# Altium schematic sheet USB3toSerial.SchDoc
size A4; SheetNumber: 4; SheetTotal: 5
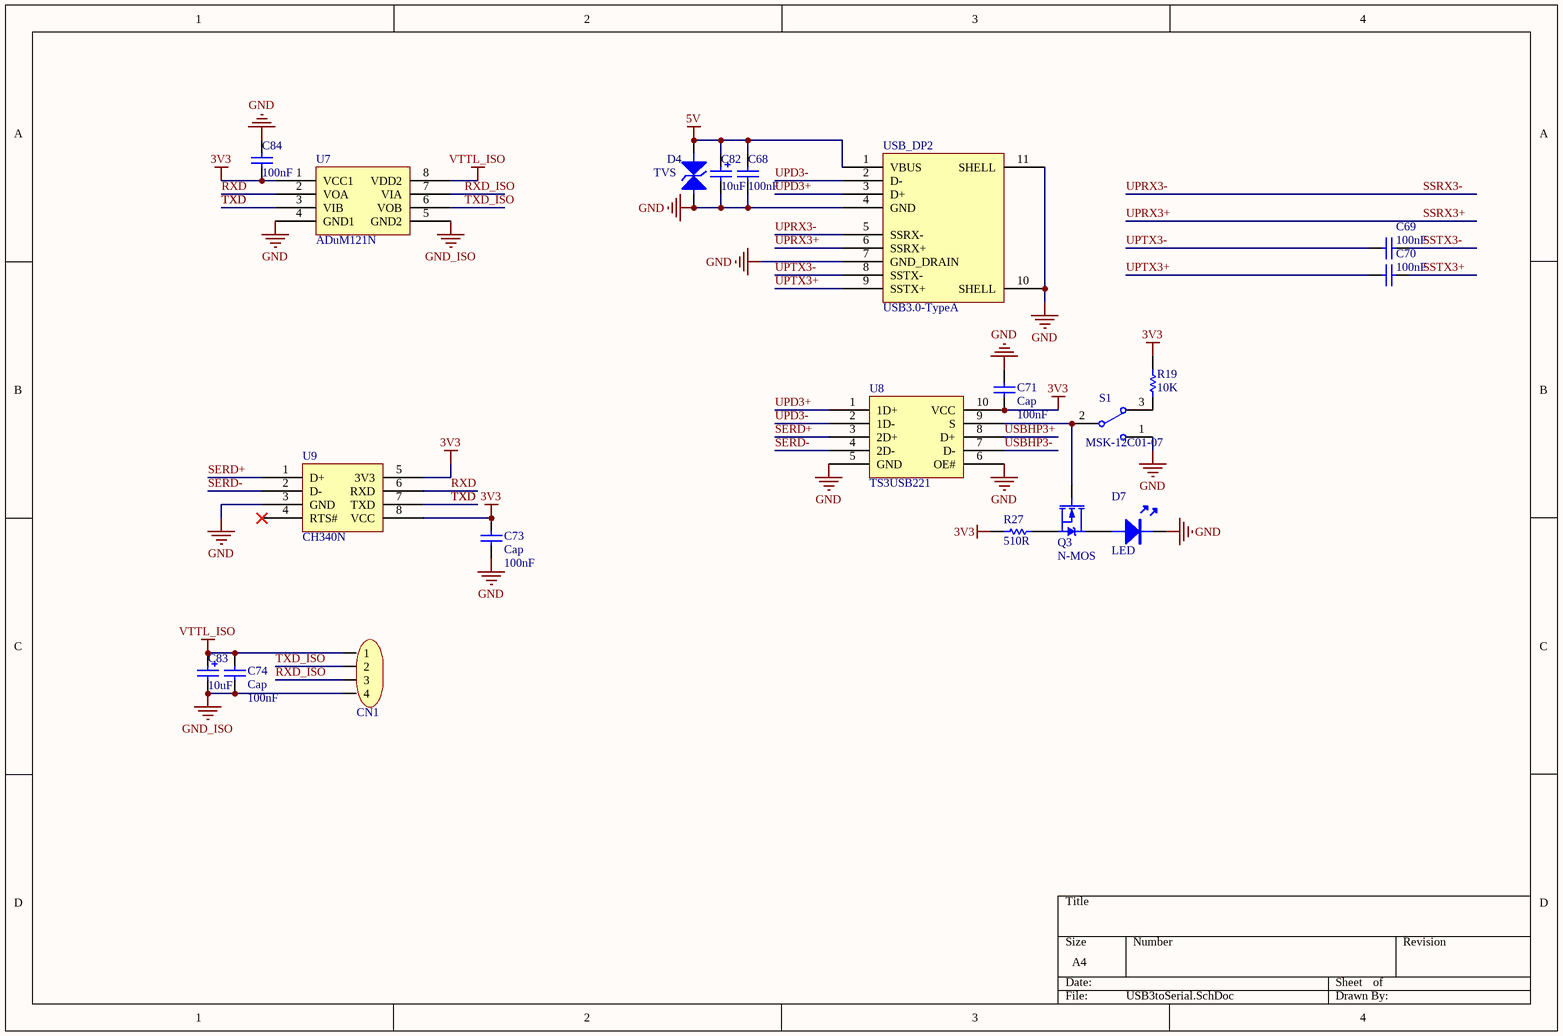
[diagram p0: USB3toSerial.SchDoc]

## Parts
C68  value 100nF  [C0603_M]  (hidden comment: Cap)
C69  value 100nF  [C0402_M]  (hidden comment: Cap)
C70  value 100nF  [C0402_M]  (hidden comment: Cap)
C71  Cap  value 100nF  [C0603_M]
C73  Cap  value 100nF  [C0603_M]
C74  Cap  value 100nF  [C0603_M]
C82  value 10uF  [TAJ-A/3216]  (hidden comment: Cap Pol2)
C83  value 10uF  [TAJ-A/3216]  (hidden comment: Cap Pol2)
C84  value 100nF  [C0603_M]  (hidden comment: Cap)
CN1  HDGC1002WR-S-4P  [XH2.54-WI-4P]  (value not drawn)
D4  TVS  [SOD-123]
D7  LED  [LED0402_B]
Q3  N-MOS  [SOT-723_L1.2-W0.8-P0.40-LS1.2-BR]
R19  value 10K  [R0603_M]  (hidden comment: Res1)
R27  value 510R  [R0603_M]  (hidden comment: Res1)
S1  MSK-12C01-07  [MSK-12C01-07]
U7  ADuM121N  [SOP8_M]
U8  TS3USB221  [UQFN-10_L2.0-W1.5-P0.50-BL]
U9  CH340N  [SOP8_M]
USB_DP2  USB3.0-TypeA  [USB3.1 Type-A_DIP_F]

## Nets
3V3: C71.1 C73.2 C84.1 R19.2 R27.2 U7.1(VCC1) U8.10(VCC) U9.5(3V3) U9.8(VCC)
5V: C68.2 C82.1 D4.K USB_DP2.1(VBUS)
GND: C68.1 C71.2 C73.1 C82.2 C84.2 D4.A D7.K S1.1 U7.4(GND1) U8.5(GND) U8.6(OE#) U9.3(GND) USB_DP2.4(GND) USB_DP2.7(GND_DRAIN) USB_DP2.10(SHELL) USB_DP2.11(SHELL)
GND_ISO: C74.1 C83.2 CN1.4 U7.5(GND2)
VTTL_ISO: C74.2 C83.1 CN1.1 U7.8(VDD2)
RXD: U7.2(VOA) U9.6(RXD)
RXD_ISO: CN1.3 U7.7(VIA)
SERD+: U8.3(2D+) U9.1(D+)
SERD-: U8.4(2D-) U9.2(D-)
SSRX3+: USB_DP2.6(SSRX+)  [also labelled UPRX3+]
SSRX3-: USB_DP2.5(SSRX-)  [also labelled UPRX3-]
SSTX3+: C70.1
SSTX3-: C69.1
TXD: U7.3(VIB) U9.7(TXD)
TXD_ISO: CN1.2 U7.6(VOB)
UPD3+: U8.1(1D+) USB_DP2.3(D+)
UPD3-: U8.2(1D-) USB_DP2.2(D-)
UPTX3+: C70.2 USB_DP2.9(SSTX+)
UPTX3-: C69.2 USB_DP2.8(SSTX-)
USBHP3+: U8.8(D+)
USBHP3-: U8.7(D-)
NetD7_A: D7.A Q3.D
NetQ3_G: Q3.G S1.2 U8.9(S)
NetQ3_S: Q3.S R27.1
NetR19_1: R19.1 S1.3

Not connected (* = marked no-connect by the designer): U9 4(RTS#)*

## Library data of the parts
C68-C71 C73 C74 C84 = Cap: Capacitor; Published: 8-Jun-2000; LatestRevisionDate: 17-Jul-2002; LatestRevisionNote: Re-released for DXP Platform.; PackageReference: RAD-0.3; Publisher: Altium Limited; PackageDescription: Radial Cap, Thru-Hole; 2 Leads; 0.3 in Pin Spacing
C82 C83 = Cap Pol2: Polarized Capacitor (Axial); Published: 8-Jun-2000; LatestRevisionDate: 17-Jul-2002; LatestRevisionNote: Re-released for DXP Platform.; PackageReference: POLAR0.8; Publisher: Altium Limited; PackageDescription: Polarized Capacitor; 2 Leads
CN1 = 4P端子不带固定脚: Manufacturer: HDGC(华德共创); Add into BOM: yes; Name: HDGC1002WR-S-4P; Symbol: HDGC1002WR-S-4P; Device: HDGC1002WR-S-4P; LCSC Part Name: SH1.0针座卧贴 4P; Supplier Part: C2936214; Manufacturer Part: HDGC1002WR-S-4P; Supplier Footprint: SMD,P=1mm; JLCPCB Part Class: 扩展库; Datasheet: https://atta.szlcsc.com/upload/public/pdf/source/20211229/E8A09E85670B5E97244D2008A24D97FE.pdf; Supplier: LCSC; Convert to PCB: yes
D4 = TVS: 双向瞬态抑制二极管
D7 = LED: pin to pad: A>1 K>2
Q3 = N-MOS: N沟道场效应管; pin to pad: D>3 G>1 S>2
R19 R27 = Res1: Resistor; Published: 8-Jun-2000; LatestRevisionDate: 17-Jul-2002; LatestRevisionNote: Re-released for DXP Platform.; PackageReference: AXIAL-0.3; Publisher: Altium Limited; PackageDescription: Axial Device, Thru-Hole; 2 Leads; 0.3 in Pin Spacing